# Altium schematic sheet 4_P2_LCD_SD.schdoc
size 307 x 218 mm; Symbol: Sheet-Symbol_A4; Device: Sheet-Symbol_A4; @Project Name: modular_design; @Page Count: 7; @Update Date: 2026-07-07; @Create Date: 2026-06-30; @Schematic Name: Schematic1; @Page No: 4; @Page Name: P2_LCD_SD; @Board Name: Board1; Company: 嘉立创EDA; Version: V1.0; Page Size: A4; Convert to PCB: yes; Add into BOM: yes; Title Block Position: 3; Width: 1170; Height: 825; Region Start: 1; X Region Count: 6; Y Region Count: 4; Blade Width: 10; @Create Time: 06:55:04; @Update Time: 14:41:44
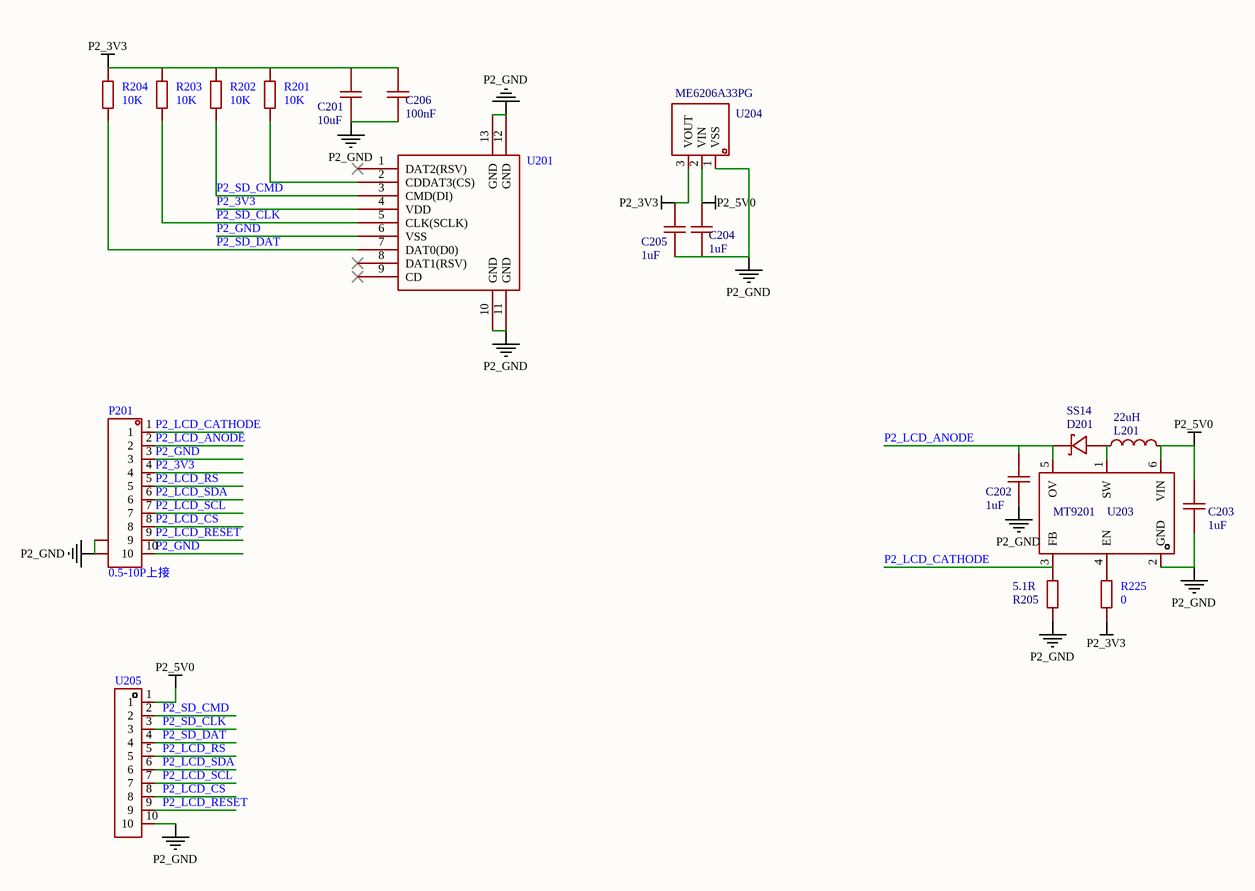
[diagram p0: 4_P2_LCD_SD.schdoc]

## Parts
C201  10uF  [C0603]
C202  1uF  [C0805]
C203  1uF  [C0805]
C204  1uF  [C0603]
C205  1uF  [C0603]
C206  100nF  [C0603]
D201  SS14  [SMA_L4.3-W2.6-LS5.2-RD]
L201  22uH  [IND-SMD_L4.0-W4.0]
P201  0.5-10P上接  [FPC_0.5_10P_mirror]
R201  10K  [R0603]
R202  10K  [R0603]
R203  10K  [R0603]
R204  10K  [R0603]
R205  5.1R  [R0603]
R225  0  [R0603]
U201  (no value)  [TF-01A]
U203  (no value)  [SOT-23-6_L2.9-W1.6-P0.95-LS2.8-BR]
U204  ME6206A33PG  [SOT-89-3_L4.5-W2.5-P1.50-LS4.2-BR]
U205  (no value)  [connector_p10_1.5mm]

## Nets
P2_3V3: C201.2 C205.2 C206.2 P201.4 R201.1 R202.2 R203.2 R204.2 R225.1 U201.4(VDD) U204.3(VOUT)
P2_5V0: C203.2 C204.2 L201.1 U203.6(VIN) U204.2(VIN) U205.1
P2_GND: C201.1 C202.1 C203.1 C204.1 C205.1 C206.1 P201.3 P201.10 P201.11 P201.12 R205.1 U201.6(VSS) U201.10(GND) U201.11(GND) U201.12(GND) U201.13(GND) U203.2(GND) U204.1(VSS) U205.10
P2_LCD_ANODE: C202.2 D201.1(K) P201.2 U203.5(OV)
P2_LCD_CATHODE: P201.1 R205.2 U203.3(FB)
P2_LCD_CS: P201.8 U205.8
P2_LCD_RESET: P201.9 U205.9
P2_LCD_RS: P201.5 U205.5
P2_LCD_SCL: P201.7 U205.7
P2_LCD_SDA: P201.6 U205.6
P2_SD_CLK: R203.1 U201.5(CLK(SCLK)) U205.3
P2_SD_CMD: R202.1 U201.3(CMD(DI)) U205.2
P2_SD_DAT: R204.1 U201.7(DAT0(D0)) U205.4
NetD201_2: D201.2(A) L201.2 U203.1(SW)
NetR201_2: R201.2 U201.2(CDDAT3(CS))
NetR225_2: R225.2 U203.4(EN)

Not connected (* = marked no-connect by the designer): U201 1(DAT2(RSV))* 8(DAT1(RSV))* 9(CD)*

## Notes on the sheet
- 1
- 2
- 3
- 4
- 5
- 6
- A
- B
- C
- 原理图
- Schematic1
- 创建日期
- 更新日期
- 2026-06-30
- 2026-07-07
- 绘制
- 板子
- Board1
- 图页
- P2_LCD_SD
- D
- 审阅
- 版本
- 尺寸
- modular_design
- 页
- 共
- 7
- V1.0
- A4
- 嘉立创EDA

## Library data of the parts
C201 C204 C205 = CAP_0603: Convert to PCB: yes; Value: 100nF; Symbol: CAP_0603; Device: CAP_0603; Add into BOM: yes; Supplier Footprint: 0603; Origin Footprint: C0603
C202 C203 = CAP_0603: Convert to PCB: yes; Value: 100nF; Origin Footprint: C0603; Symbol: CAP_0603; Device: CAP_0603; Add into BOM: yes; Supplier Footprint: 0603
C206 = CAP_0603: Convert to PCB: yes; Symbol: CAP_0603; Device: CAP_0603; Add into BOM: yes; Supplier Footprint: 0603; Value: 100nF; Origin Footprint: C0603
D201 = SS14_C84343: Manufacturer: 星海; Add into BOM: yes; Reverse Voltage (Vr): 40V; Average Rectified Current (Io): 1A; Forward Voltage (Vf@If): 550mV@1A; Symbol: SS14_C84343; Device: SS14_C84343; LCSC Part Name: 40V 1A 550mV@1A; Supplier Part: C84343; Manufacturer Part: SS14; Supplier Footprint: SMA(DO-214AC); JLCPCB Part Class: Extended Part; Datasheet: https://atta.szlcsc.com/upload/public/pdf/source/20161024/1477288629719.pdf; Supplier: LCSC; Convert to PCB: yes; Origin Footprint: SMA_L4.3-W2.6-LS5.2-RD
L201 = YNR4030-220M: Manufacturer: YJYCOIN(益嘉源); Add into BOM: yes; Tolerance: ±20%; Rated Current: 1A; DC Resistance (DCR): 225mΩ; Symbol: YNR4030-220M; Device: YNR4030-220M; LCSC Part Name: 22uH ±20% 1A 225mΩ; Supplier Part: C341013; Manufacturer Part: YNR4030-220M; Supplier Footprint: SMD,4x4x3mm; JLCPCB Part Class: Extended Part; Datasheet: https://atta.szlcsc.com/upload/public/pdf/source/20200623/C340386_9AA10DB3E9692149FF2BB278AFBCE083.pdf; Supplier: LCSC; Convert to PCB: yes; Value: 22uH; Origin Footprint: IND-SMD_L4.0-W4.0
P201 = 0.5-10P上接: Manufacturer: BOOMELE(博穆精密); Symbol: FPC 0.5MM 10P Pull type H2.0mm Pick up; Add into BOM: yes; Pitch: 0.5mm; Number of Contacts: 10; Locking Feature: 抽屉式; Device: 0.5-10P上接; LCSC Part Name: 0.5mm P数:10 抽屉式 上接; Supplier Part: C11085; Manufacturer Part: 0.5-10P上接; Supplier Footprint: SMD,P=0.5mm; JLCPCB Part Class: Extended Part; Datasheet: https://atta.szlcsc.com/upload/public/pdf/source/20130129/1457706582552.pdf; Supplier: LCSC; Convert to PCB: yes; Mounting Type: 卧贴; Contact Type: 上接; Height Above Board: 2mm; FFC, FCB Thickness: -
R201-R204 = Res_0603: Symbol: 电阻; Convert to PCB: yes; Device: Res_0603; Add into BOM: yes; Supplier Footprint: 0603; Value: 10K
R205 = Res_0603: Convert to PCB: yes; Value: 10K; Symbol: Res_0603; Device: Res_0603; Add into BOM: yes; Supplier Footprint: 0603; Origin Footprint: R0603
R225 = Res_0603: Symbol: 电阻; Convert to PCB: yes; Value: 10K; Device: Res_0603; Add into BOM: yes; Supplier Footprint: 0603
U201 = TF-01A: Add into BOM: yes; Symbol: TF-01A; Device: TF-01A; Convert to PCB: yes
U203 = MT9201: Add into BOM: yes; Symbol: MT9201; Device: MT9201; Convert to PCB: yes; Origin Footprint: SOT-23-6_L2.9-W1.6-P0.95-LS2.8-BR
U204 = ME6209A33PG: Manufacturer: MICRONE(南京微盟); Add into BOM: yes; Output Type: 固定; Output Polarity: 正; Number of Outputs: 1; Maximum Input Voltage: 18V; Output Voltage: 3.3V; Dropout Voltage: 80mV@(40mA); Output Current: 250mA; Symbol: ME6209A33PG; Device: ME6209A33PG; LCSC Part Name: Vin=18V Vout=3.3V 250mA; Supplier Part: C80222; Manufacturer Part: ME6209A33PG; Supplier Footprint: SOT-89(SOT-89-3); JLCPCB Part Class: Extended Part; Datasheet: https://atta.szlcsc.com/upload/public/pdf/source/20160903/1472896599532.pdf; Supplier: LCSC; Convert to PCB: yes; Power Supply Rejection Ratio (PRSS): -; Origin Footprint: SOT-89-3_L4.5-W2.5-P1.50-LS4.2-BR
U205 = connector_p10_1.5mm: Add into BOM: yes; Symbol: connector_p10_1.5mm; Device: connector_p10_1.5mm; Convert to PCB: yes